# Altium schematic sheet Sheet1.SchDoc
size A4
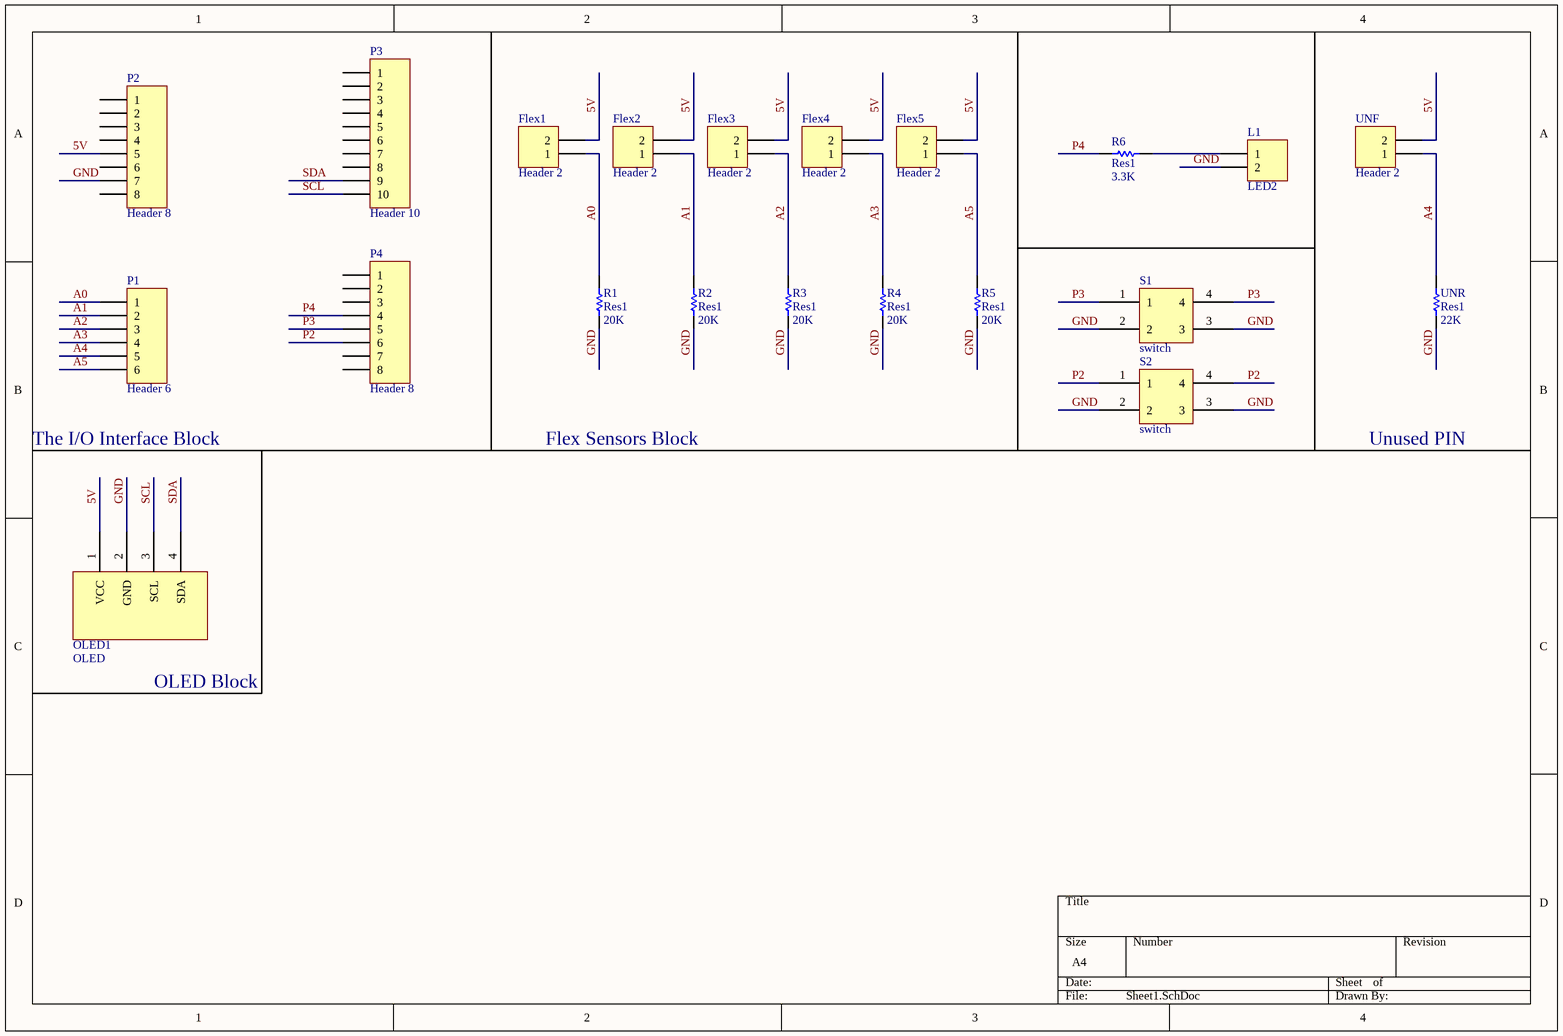
[diagram p0: Sheet1.SchDoc]

## Parts
Flex1  Header 2  [HDR1X2]
Flex2  Header 2  [HDR1X2]
Flex3  Header 2  [HDR1X2]
Flex4  Header 2  [HDR1X2]
Flex5  Header 2  [HDR1X2]
L1  LED2  [HDR1X2]
OLED1  OLED  [OLED]
P1  Header 6  [HDR1X6]
P2  Header 8  [HDR1X8]
P3  Header 10  [HDR1X10]
P4  Header 8  [HDR1X8]
R1  Res1  value 20K  [AXIAL-0.3]
R2  Res1  value 20K  [AXIAL-0.3]
R3  Res1  value 20K  [AXIAL-0.3]
R4  Res1  value 20K  [AXIAL-0.3]
R5  Res1  value 20K  [AXIAL-0.3]
R6  Res1  value 3.3K  [AXIAL-0.3]
S1  switch  [switch]
S2  switch  [switch]
UNF  Header 2  [HDR1X2]
UNR  Res1  value 22K  [AXIAL-0.3]

## Nets
5V: Flex1.2 Flex2.2 Flex3.2 Flex4.2 Flex5.2 OLED1.1(VCC) P2.5 UNF.2
A0: Flex1.1 P1.1 R1.2
A1: Flex2.1 P1.2 R2.2
A2: Flex3.1 P1.3 R3.2
A3: Flex4.1 P1.4 R4.2
A4: P1.5 UNF.1 UNR.2
A5: Flex5.1 P1.6 R5.2
GND: L1.2 OLED1.2(GND) P2.7 R1.1 R2.1 R3.1 R4.1 R5.1 S1.2 S1.3 S2.2 S2.3 UNR.1
P2: P4.6 S2.1 S2.4
P3: P4.5 S1.1 S1.4
P4: P4.4 R6.1
SCL: OLED1.3(SCL) P3.10
SDA: OLED1.4(SDA) P3.9
NetL1_1: L1.1 R6.2

Not connected (* = marked no-connect by the designer): P2 1 2 3 4 6 8; P3 1 2 3 4 5 6 7 8; P4 1 2 3 7 8

## Notes on the sheet
- The I/O Interface Block
- Flex Sensors Block
- Unused PIN
- OLED Block

## Library data of the parts
Flex1-Flex5 L1 UNF = Header 2: Header, 2-Pin; LatestRevisionDate: 17-Jul-2002; LatestRevisionNote: Re-released for DXP Platform.; Publisher: Altium Limited
P1 = Header 6: Header, 6-Pin; LatestRevisionDate: 17-Jul-2002; LatestRevisionNote: Re-released for DXP Platform.; Publisher: Altium Limited
P2 P4 = Header 8: Header, 8-Pin; LatestRevisionDate: 17-Jul-2002; LatestRevisionNote: Re-released for DXP Platform.; Publisher: Altium Limited
P3 = Header 10: Header, 10-Pin; LatestRevisionDate: 17-Jul-2002; LatestRevisionNote: Re-released for DXP Platform.; Publisher: Altium Limited
R1-R6 UNR = Res1: Resistor; Published: 8-Jun-2000; LatestRevisionDate: 17-Jul-2002; LatestRevisionNote: Re-released for DXP Platform.; PackageReference: AXIAL-0.3; Publisher: Altium Limited; PackageDescription: Axial Device, Thru-Hole; 2 Leads; 0.3 in Pin Spacing